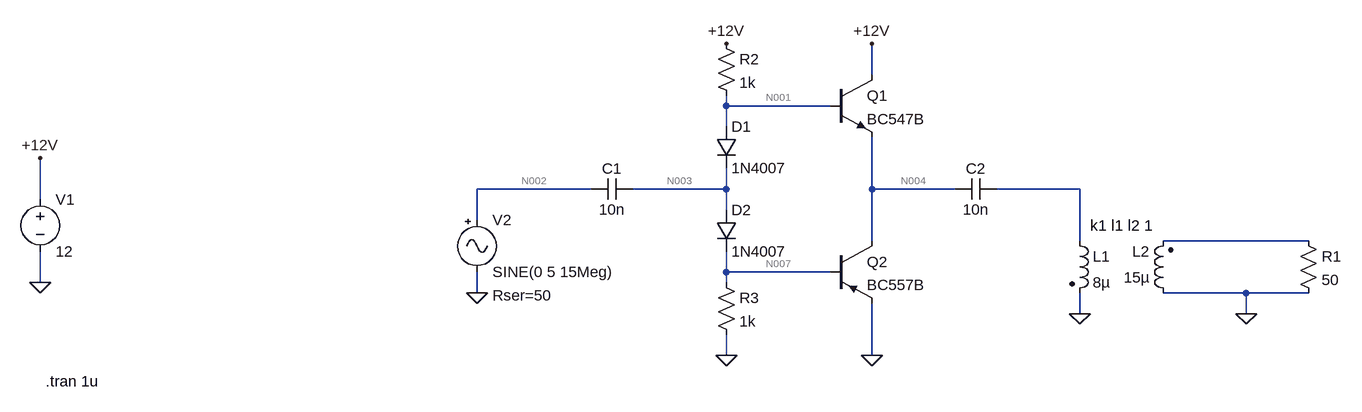
[diagram p0: schematic 10W QRP Amplifier class A.asc]
10W QRP Amplifier class A.asc, the LTspice schematic file:
Version 4
SHEET 1 1112 680
WIRE 288 -80 288 -128
WIRE 64 -32 64 -48
WIRE 224 -32 64 -32
WIRE 64 0 64 -32
WIRE -144 96 -320 96
WIRE 64 96 64 64
WIRE 64 96 -80 96
WIRE 288 96 288 16
WIRE 416 96 288 96
WIRE 608 96 480 96
WIRE -992 112 -992 48
WIRE 64 128 64 96
WIRE -320 144 -320 96
WIRE 288 176 288 96
WIRE 608 176 608 96
WIRE 960 176 736 176
WIRE 64 224 64 192
WIRE 224 224 64 224
WIRE -992 240 -992 192
WIRE 64 240 64 224
WIRE -320 256 -320 224
WIRE 864 256 736 256
WIRE 960 256 864 256
WIRE 608 288 608 256
WIRE 864 288 864 256
WIRE 64 352 64 320
WIRE 288 352 288 272
FLAG 864 288 0
FLAG -992 240 0
FLAG -320 256 0
FLAG 288 352 0
FLAG 288 -128 +12V
FLAG -992 48 +12V
FLAG 608 288 0
FLAG 64 -128 +12V
FLAG 64 352 0
SYMBOL ind2 592 160 R0
SYMATTR InstName L1
SYMATTR Value 8µ
SYMATTR Type ind
SYMBOL ind2 752 272 R180
WINDOW 0 36 80 Left 2
WINDOW 3 36 40 Left 2
SYMATTR InstName L2
SYMATTR Value 15µ
SYMATTR Type ind
SYMBOL res 944 160 R0
SYMATTR InstName R1
SYMATTR Value 50
SYMBOL cap -80 80 R90
WINDOW 0 0 32 VBottom 2
WINDOW 3 32 32 VTop 2
SYMATTR InstName C1
SYMATTR Value 10n
SYMBOL voltage -992 96 R0
WINDOW 123 0 0 Left 0
WINDOW 39 0 0 Left 0
SYMATTR InstName V1
SYMATTR Value 12
SYMBOL Misc\\signal -320 128 R0
WINDOW 123 0 0 Left 0
WINDOW 39 24 132 Left 2
SYMATTR SpiceLine Rser=50
SYMATTR InstName V2
SYMATTR Value SINE(0 5 15Meg)
SYMBOL npn 224 -80 R0
SYMATTR InstName Q1
SYMATTR Value BC547B
SYMBOL pnp 224 176 R0
SYMATTR InstName Q2
SYMATTR Value BC557B
SYMBOL diode 48 0 R0
SYMATTR InstName D1
SYMATTR Value 1N4007
SYMBOL diode 48 128 R0
SYMATTR InstName D2
SYMATTR Value 1N4007
SYMBOL res 48 -144 R0
SYMATTR InstName R2
SYMATTR Value 1k
SYMBOL res 48 224 R0
SYMATTR InstName R3
SYMATTR Value 1k
SYMBOL cap 480 80 R90
WINDOW 0 0 32 VBottom 2
WINDOW 3 32 32 VTop 2
SYMATTR InstName C2
SYMATTR Value 10n
TEXT 624 152 Left 2 !k1 l1 l2 1
TEXT -984 392 Left 2 !.tran 1u

The netlist it stands for:
* 10W QRP Amplifier class A.asc
L1 N005 0 8µ
L2 0 N006 15µ
R1 N006 0 50
C1 N003 N002 10n
V1 +12V 0 12
V2 N002 0 SINE(0 5 15Meg) Rser=50
Q1 +12V N001 N004 0 BC547B
Q2 N004 N007 0 0 BC557B
D1 N001 N003 1N4007
D2 N003 N007 1N4007
R2 +12V N001 1k
R3 N007 0 1k
C2 N005 N004 10n
.model D D
.lib standard.dio
.model NPN NPN
.model PNP PNP
.lib standard.bjt
k1 l1 l2 1
.tran 1u
.backanno
.end

* Results of the author's LTspice run, read from the files saved beside the schematic
* Operating Point, zero values left out:
*   V(n003) = 6.088 V
*   V(+12v) = 12 V
*   V(n001) = 6.735 V
*   V(n004) = 6.079 V
*   V(n007) = 5.44 V
*   Ic(Q1) = 2.073 mA
*   Ib(Q1) = 6.803 µA
*   Ie(Q1) = -2.08 mA
*   Ic(Q2) = 2.08 mA
*   Ib(Q2) = -182.2 µA
*   Ie(Q2) = -1.898 mA
*   I(D1) = 5.258 mA
*   I(D2) = 5.258 mA
*   I(R2) = 5.265 mA
*   I(R3) = 5.44 mA
*   I(V1) = -7.338 mA
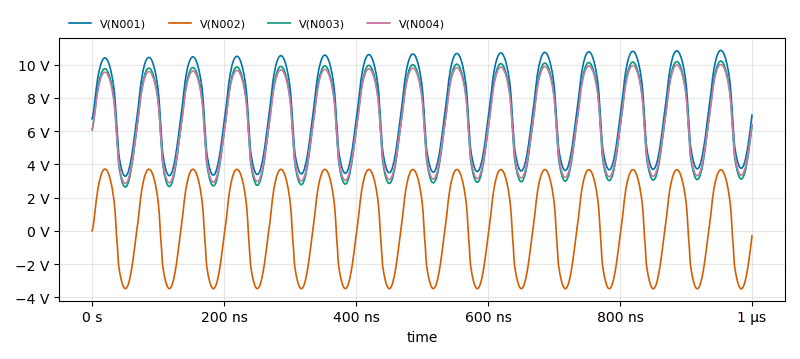
[diagram p1: Transient Analysis of 10W QRP Amplifier class A.asc, plotted from the saved traces]
* Transient Analysis, 1 run:
*   V(N001): min 3.282 V, max 10.85 V, average 7.243 V, rms 7.711 V, last 6.962 V
*   V(N002): min -3.486 V, max 3.714 V, average 266.1 mV, rms 2.683 V, last -304.9 mV
*   V(N003): min 2.634 V, max 10.21 V, average 6.596 V, rms 7.107 V, last 6.315 V
*   V(N004): min 2.853 V, max 10 V, average 6.592 V, rms 7.043 V, last 6.379 V